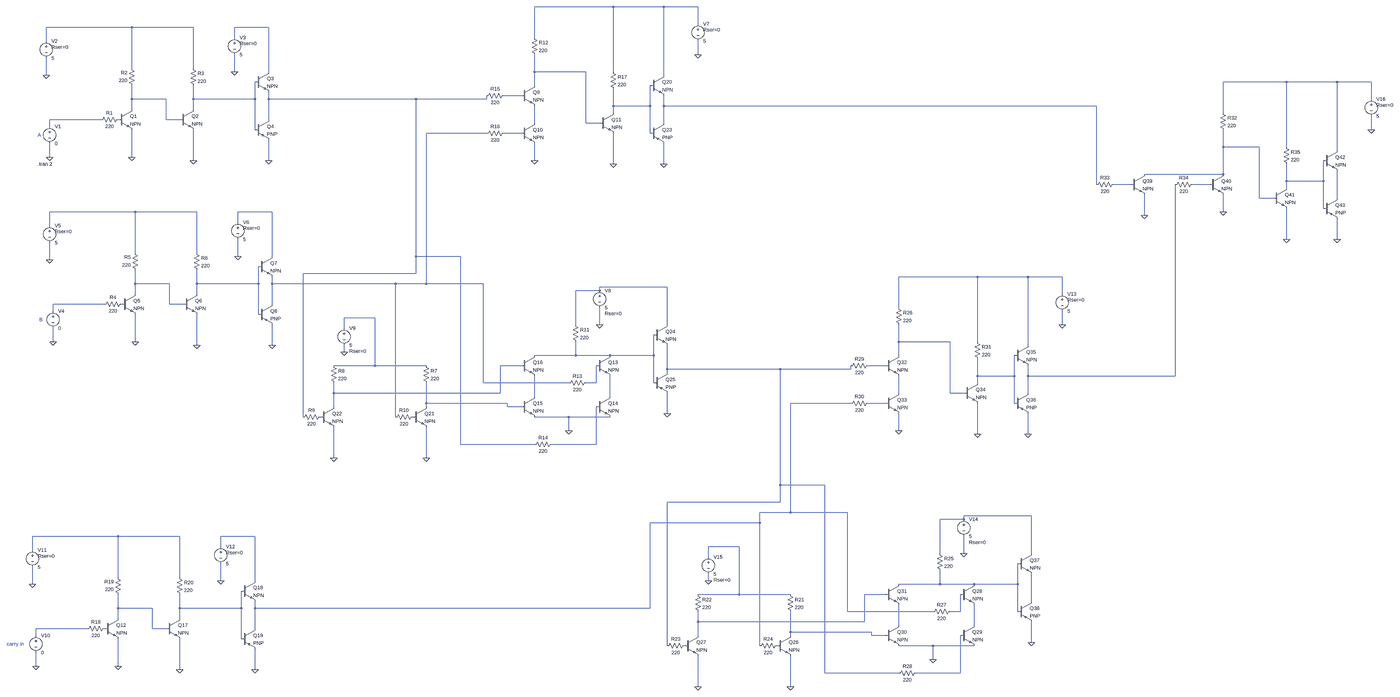
[diagram p0: schematic TTL Full Adder.asc, whole sheet]
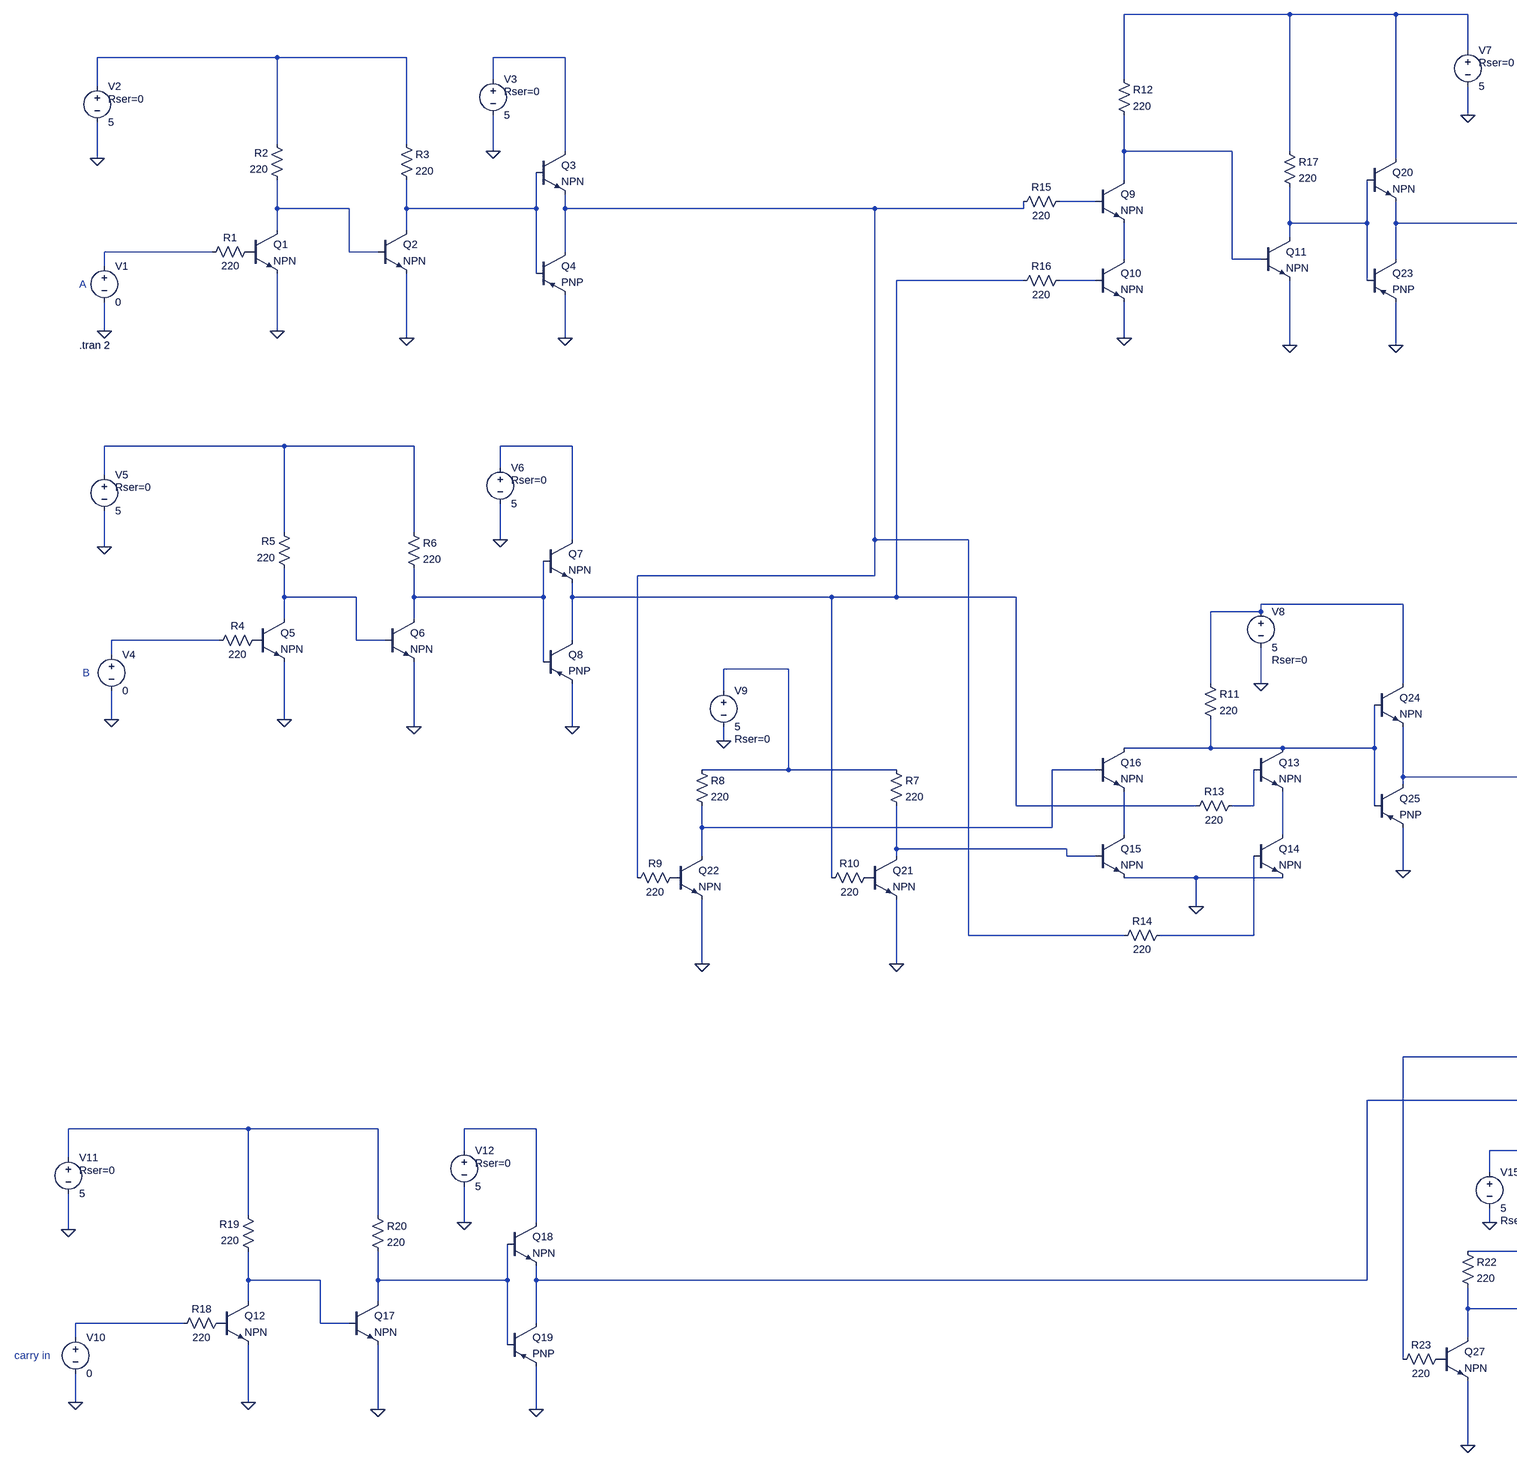
[diagram p1: schematic TTL Full Adder.asc, part, row 1 of 1, column 1 of 2]
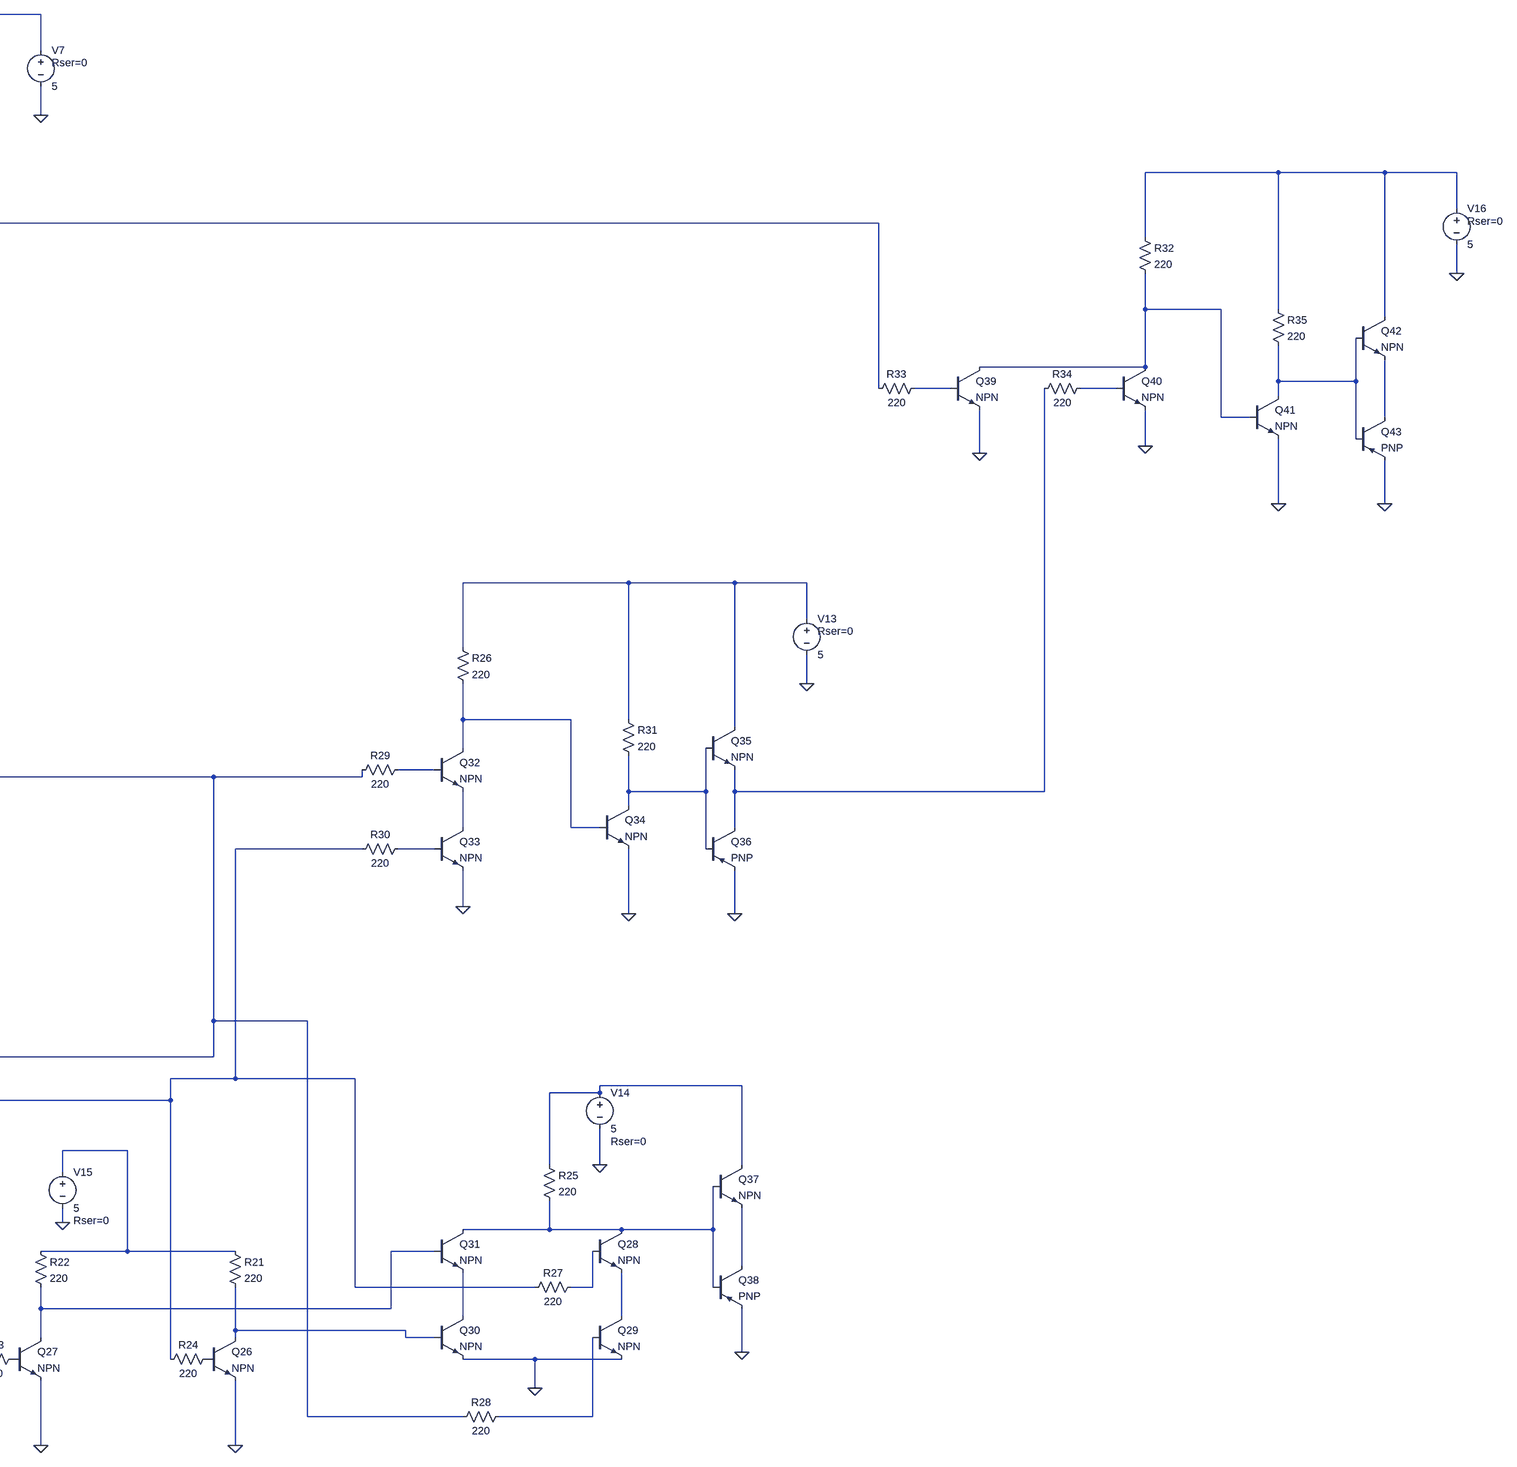
[diagram p2: schematic TTL Full Adder.asc, part, row 1 of 1, column 2 of 2]
TTL Full Adder.asc, the LTspice schematic file:
Version 4.1
SHEET 1 7312 2580
WIRE 3152 -816 2784 -816
WIRE 3488 -816 3152 -816
WIRE 3648 -816 3488 -816
WIRE 3648 -736 3648 -816
WIRE 576 -720 176 -720
WIRE 864 -720 576 -720
WIRE 1216 -720 1056 -720
WIRE 1056 -672 1056 -720
WIRE 2784 -672 2784 -816
WIRE 176 -656 176 -720
WIRE 3648 -592 3648 -656
WIRE 576 -528 576 -720
WIRE 864 -528 864 -720
WIRE 1056 -512 1056 -592
WIRE 1216 -512 1216 -720
WIRE 2784 -512 2784 -592
WIRE 3024 -512 2784 -512
WIRE 3152 -512 3152 -816
WIRE 176 -496 176 -576
WIRE 3488 -496 3488 -816
WIRE 6704 -464 6336 -464
WIRE 7040 -464 6704 -464
WIRE 7200 -464 7040 -464
WIRE 2784 -448 2784 -512
WIRE 2720 -400 2640 -400
WIRE 576 -384 576 -448
WIRE 736 -384 576 -384
WIRE 864 -384 864 -448
WIRE 1152 -384 1152 -464
WIRE 1152 -384 864 -384
WIRE 1216 -384 1216 -416
WIRE 2208 -384 1216 -384
WIRE 2560 -384 2560 -400
WIRE 2560 -384 2208 -384
WIRE 7200 -384 7200 -464
WIRE 3152 -352 3152 -432
WIRE 3424 -352 3424 -448
WIRE 3424 -352 3152 -352
WIRE 3488 -352 3488 -400
WIRE 5632 -352 3488 -352
WIRE 576 -336 576 -384
WIRE 864 -336 864 -384
WIRE 3152 -320 3152 -352
WIRE 6336 -320 6336 -464
WIRE 432 -288 192 -288
WIRE 736 -288 736 -384
WIRE 800 -288 736 -288
WIRE 1216 -288 1216 -384
WIRE 2784 -272 2784 -352
WIRE 3024 -272 3024 -512
WIRE 3088 -272 3024 -272
WIRE 3488 -272 3488 -352
WIRE 192 -256 192 -288
WIRE 1152 -240 1152 -384
WIRE 7200 -240 7200 -304
WIRE 2560 -224 2256 -224
WIRE 2720 -224 2640 -224
WIRE 3424 -224 3424 -352
WIRE 6336 -160 6336 -240
WIRE 6576 -160 6336 -160
WIRE 6704 -160 6704 -464
WIRE 7040 -144 7040 -464
WIRE 192 -112 192 -176
WIRE 576 -112 576 -240
WIRE 864 -96 864 -240
WIRE 1216 -96 1216 -192
WIRE 2784 -96 2784 -176
WIRE 3152 -80 3152 -224
WIRE 3488 -80 3488 -176
WIRE 6336 -32 6336 -160
WIRE 6336 -32 5856 -32
WIRE 6704 0 6704 -80
WIRE 6976 0 6976 -96
WIRE 6976 0 6704 0
WIRE 5632 16 5632 -352
WIRE 5792 16 5712 16
WIRE 6272 16 6192 16
WIRE 6704 32 6704 0
WIRE 6576 80 6576 -160
WIRE 6640 80 6576 80
WIRE 7040 80 7040 -48
WIRE 6976 128 6976 0
WIRE 592 144 192 144
WIRE 880 144 592 144
WIRE 1232 144 1072 144
WIRE 6336 144 6336 64
WIRE 5856 160 5856 64
WIRE 1072 192 1072 144
WIRE 192 208 192 144
WIRE 6704 272 6704 128
WIRE 7040 272 7040 176
WIRE 592 336 592 144
WIRE 880 336 880 144
WIRE 1072 352 1072 272
WIRE 1232 352 1232 144
WIRE 2208 352 2208 -384
WIRE 2416 352 2208 352
WIRE 192 368 192 288
WIRE 2208 432 2208 352
WIRE 2208 432 1680 432
WIRE 4976 448 4608 448
WIRE 5312 448 4976 448
WIRE 5472 448 5312 448
WIRE 592 480 592 416
WIRE 752 480 592 480
WIRE 880 480 880 416
WIRE 1168 480 1168 400
WIRE 1168 480 880 480
WIRE 1232 480 1232 448
WIRE 2112 480 1232 480
WIRE 2256 480 2256 -224
WIRE 2256 480 2112 480
WIRE 2544 480 2256 480
WIRE 3504 496 3088 496
WIRE 3088 512 3088 496
WIRE 3088 512 2976 512
WIRE 592 528 592 480
WIRE 880 528 880 480
WIRE 5472 528 5472 448
WIRE 448 576 208 576
WIRE 752 576 752 480
WIRE 816 576 752 576
WIRE 1232 576 1232 480
WIRE 4608 592 4608 448
WIRE 208 608 208 576
WIRE 1168 624 1168 480
WIRE 2016 640 1872 640
WIRE 2976 672 2976 512
WIRE 3088 672 3088 592
WIRE 3504 672 3504 496
WIRE 5472 672 5472 608
WIRE 1872 688 1872 640
WIRE 208 752 208 688
WIRE 592 752 592 624
WIRE 4608 752 4608 672
WIRE 4848 752 4608 752
WIRE 4976 752 4976 448
WIRE 880 768 880 624
WIRE 1232 768 1232 672
WIRE 5312 768 5312 448
WIRE 1872 800 1872 768
WIRE 2976 816 2976 752
WIRE 2976 816 2784 816
WIRE 3136 816 2976 816
WIRE 3440 816 3440 720
WIRE 3440 816 3136 816
WIRE 4608 816 4608 752
WIRE 2016 864 2016 640
WIRE 2016 864 1824 864
WIRE 2256 864 2016 864
WIRE 2720 864 2624 864
WIRE 4544 864 4464 864
WIRE 3504 880 3504 768
WIRE 4032 880 3504 880
WIRE 4384 880 4384 864
WIRE 4384 880 4032 880
WIRE 3504 896 3504 880
WIRE 4976 912 4976 832
WIRE 5248 912 5248 816
WIRE 5248 912 4976 912
WIRE 5312 912 5312 864
WIRE 6112 912 6112 16
WIRE 6112 912 5312 912
WIRE 2544 944 2544 480
WIRE 2944 944 2544 944
WIRE 3072 944 3072 864
WIRE 3072 944 3024 944
WIRE 3440 944 3440 816
WIRE 4976 944 4976 912
WIRE 1824 992 1824 944
WIRE 2624 992 2624 864
WIRE 2624 992 1824 992
WIRE 4608 992 4608 912
WIRE 4848 992 4848 752
WIRE 4912 992 4848 992
WIRE 5312 992 5312 912
WIRE 2784 1008 2784 912
WIRE 3136 1008 3136 912
WIRE 2256 1040 2256 944
WIRE 2656 1040 2256 1040
WIRE 4384 1040 4080 1040
WIRE 4544 1040 4464 1040
WIRE 5248 1040 5248 912
WIRE 1824 1056 1824 992
WIRE 2256 1056 2256 1040
WIRE 2656 1056 2656 1040
WIRE 2720 1056 2656 1056
WIRE 3504 1088 3504 992
WIRE 1680 1104 1680 432
WIRE 2112 1104 2112 480
WIRE 2944 1104 2784 1104
WIRE 3136 1104 2944 1104
WIRE 2944 1168 2944 1104
WIRE 4608 1168 4608 1088
WIRE 4976 1184 4976 1040
WIRE 5312 1184 5312 1088
WIRE 2416 1232 2416 352
WIRE 2784 1232 2416 1232
WIRE 3072 1232 3072 1056
WIRE 3072 1232 2864 1232
WIRE 1824 1296 1824 1152
WIRE 2256 1296 2256 1152
WIRE 4032 1616 4032 880
WIRE 4240 1616 4032 1616
WIRE 4032 1696 4032 1616
WIRE 4032 1696 3504 1696
WIRE 4080 1744 4080 1040
WIRE 4080 1744 3936 1744
WIRE 4368 1744 4080 1744
WIRE 5328 1760 4912 1760
WIRE 4912 1776 4912 1760
WIRE 4912 1776 4800 1776
WIRE 3936 1792 3936 1744
WIRE 3936 1792 3424 1792
WIRE 512 1856 112 1856
WIRE 800 1856 512 1856
WIRE 1152 1856 992 1856
WIRE 992 1904 992 1856
WIRE 3840 1904 3696 1904
WIRE 112 1920 112 1856
WIRE 4800 1936 4800 1776
WIRE 4912 1936 4912 1856
WIRE 5328 1936 5328 1760
WIRE 3696 1952 3696 1904
WIRE 512 2048 512 1856
WIRE 800 2048 800 1856
WIRE 992 2064 992 1984
WIRE 1152 2064 1152 1856
WIRE 3696 2064 3696 2032
WIRE 112 2080 112 2000
WIRE 4800 2080 4800 2016
WIRE 4800 2080 4608 2080
WIRE 4960 2080 4800 2080
WIRE 5264 2080 5264 1984
WIRE 5264 2080 4960 2080
WIRE 3840 2128 3840 1904
WIRE 3840 2128 3648 2128
WIRE 4080 2128 3840 2128
WIRE 4544 2128 4448 2128
WIRE 5328 2160 5328 2032
WIRE 512 2192 512 2128
WIRE 672 2192 512 2192
WIRE 800 2192 800 2128
WIRE 1088 2192 1088 2112
WIRE 1088 2192 800 2192
WIRE 1152 2192 1152 2160
WIRE 3424 2192 3424 1792
WIRE 3424 2192 1152 2192
WIRE 4368 2208 4368 1744
WIRE 4768 2208 4368 2208
WIRE 4896 2208 4896 2128
WIRE 4896 2208 4848 2208
WIRE 5264 2208 5264 2080
WIRE 512 2240 512 2192
WIRE 800 2240 800 2192
WIRE 3648 2256 3648 2208
WIRE 4448 2256 4448 2128
WIRE 4448 2256 3648 2256
WIRE 4608 2272 4608 2176
WIRE 4960 2272 4960 2176
WIRE 368 2288 128 2288
WIRE 672 2288 672 2192
WIRE 736 2288 672 2288
WIRE 1152 2288 1152 2192
WIRE 4080 2304 4080 2208
WIRE 4480 2304 4080 2304
WIRE 128 2320 128 2288
WIRE 3648 2320 3648 2256
WIRE 4080 2320 4080 2304
WIRE 4480 2320 4480 2304
WIRE 4544 2320 4480 2320
WIRE 1088 2336 1088 2192
WIRE 5328 2352 5328 2256
WIRE 3504 2368 3504 1696
WIRE 3936 2368 3936 1792
WIRE 4768 2368 4608 2368
WIRE 4960 2368 4768 2368
WIRE 4768 2432 4768 2368
WIRE 128 2464 128 2400
WIRE 512 2464 512 2336
WIRE 800 2480 800 2336
WIRE 1152 2480 1152 2384
WIRE 4240 2496 4240 1616
WIRE 4608 2496 4240 2496
WIRE 4896 2496 4896 2320
WIRE 4896 2496 4688 2496
WIRE 3648 2560 3648 2416
WIRE 4080 2560 4080 2416
FLAG 192 -112 0
FLAG 576 -112 0
FLAG 176 -496 0
FLAG 864 -96 0
FLAG 1056 -512 0
FLAG 1216 -96 0
FLAG 208 752 0
FLAG 592 752 0
FLAG 192 368 0
FLAG 880 768 0
FLAG 1072 352 0
FLAG 1232 768 0
FLAG 2944 1168 0
FLAG 3088 672 0
FLAG 2256 1296 0
FLAG 1824 1296 0
FLAG 1872 800 0
FLAG 2784 -96 0
FLAG 3152 -80 0
FLAG 128 2464 0
FLAG 512 2464 0
FLAG 112 2080 0
FLAG 800 2480 0
FLAG 992 2064 0
FLAG 1152 2480 0
FLAG 3488 -80 0
FLAG 3648 -592 0
FLAG 3504 1088 0
FLAG 4768 2432 0
FLAG 4912 1936 0
FLAG 4080 2560 0
FLAG 3648 2560 0
FLAG 3696 2064 0
FLAG 4608 1168 0
FLAG 4976 1184 0
FLAG 5312 1184 0
FLAG 5472 672 0
FLAG 5328 2352 0
FLAG 6336 144 0
FLAG 6704 272 0
FLAG 7040 272 0
FLAG 7200 -240 0
FLAG 5856 160 0
SYMBOL voltage 192 -272 R0
WINDOW 123 0 0 Left 0
WINDOW 39 0 0 Left 0
SYMATTR InstName V1
SYMATTR Value 0
SYMBOL npn 512 -336 R0
SYMATTR InstName Q1
SYMBOL res 528 -304 R90
WINDOW 0 0 56 VBottom 2
WINDOW 3 32 56 VTop 2
SYMATTR InstName R1
SYMATTR Value 220
SYMBOL res 592 -432 R180
WINDOW 0 36 76 Left 2
WINDOW 3 36 40 Left 2
SYMATTR InstName R2
SYMATTR Value 220
SYMBOL voltage 176 -672 R0
WINDOW 123 0 0 Left 0
WINDOW 39 24 44 Left 2
SYMATTR InstName V2
SYMATTR Value 5
SYMATTR SpiceLine Rser=0
SYMBOL res 848 -544 R0
SYMATTR InstName R3
SYMATTR Value 220
SYMBOL npn 800 -336 R0
SYMATTR InstName Q2
SYMBOL npn 1152 -512 R0
SYMATTR InstName Q3
SYMBOL pnp 1152 -288 R0
SYMATTR InstName Q4
SYMBOL voltage 1056 -688 R0
WINDOW 123 0 0 Left 0
WINDOW 39 24 44 Left 2
SYMATTR InstName V3
SYMATTR Value 5
SYMATTR SpiceLine Rser=0
SYMBOL voltage 208 592 R0
WINDOW 123 0 0 Left 0
WINDOW 39 0 0 Left 0
SYMATTR InstName V4
SYMATTR Value 0
SYMBOL npn 528 528 R0
SYMATTR InstName Q5
SYMBOL res 544 560 R90
WINDOW 0 0 56 VBottom 2
WINDOW 3 32 56 VTop 2
SYMATTR InstName R4
SYMATTR Value 220
SYMBOL res 608 432 R180
WINDOW 0 36 76 Left 2
WINDOW 3 36 40 Left 2
SYMATTR InstName R5
SYMATTR Value 220
SYMBOL voltage 192 192 R0
WINDOW 123 0 0 Left 0
WINDOW 39 24 44 Left 2
SYMATTR InstName V5
SYMATTR Value 5
SYMATTR SpiceLine Rser=0
SYMBOL res 864 320 R0
SYMATTR InstName R6
SYMATTR Value 220
SYMBOL npn 816 528 R0
SYMATTR InstName Q6
SYMBOL npn 1168 352 R0
SYMATTR InstName Q7
SYMBOL pnp 1168 576 R0
SYMATTR InstName Q8
SYMBOL voltage 1072 176 R0
WINDOW 123 0 0 Left 0
WINDOW 39 24 44 Left 2
SYMATTR InstName V6
SYMATTR Value 5
SYMATTR SpiceLine Rser=0
SYMBOL voltage 3648 -752 R0
WINDOW 123 0 0 Left 0
WINDOW 39 24 44 Left 2
SYMATTR InstName V7
SYMATTR Value 5
SYMATTR SpiceLine Rser=0
SYMBOL voltage 3088 496 R0
WINDOW 123 0 0 Left 0
WINDOW 39 24 124 Left 2
SYMATTR InstName V8
SYMATTR Value 5
SYMATTR SpiceLine Rser=0
SYMBOL res 2240 848 R0
SYMATTR InstName R7
SYMATTR Value 220
SYMBOL npn 2192 1056 R0
SYMATTR InstName Q21
SYMBOL res 1808 848 R0
SYMATTR InstName R8
SYMATTR Value 220
SYMBOL npn 1760 1056 R0
SYMATTR InstName Q22
SYMBOL res 1776 1088 R90
WINDOW 0 0 56 VBottom 2
WINDOW 3 32 56 VTop 2
SYMATTR InstName R9
SYMATTR Value 220
SYMBOL res 2208 1088 R90
WINDOW 0 0 56 VBottom 2
WINDOW 3 32 56 VTop 2
SYMATTR InstName R10
SYMATTR Value 220
SYMBOL voltage 1872 672 R0
WINDOW 123 0 0 Left 0
WINDOW 39 24 124 Left 2
SYMATTR InstName V9
SYMATTR Value 5
SYMATTR SpiceLine Rser=0
SYMBOL res 2960 656 R0
SYMATTR InstName R11
SYMATTR Value 220
SYMBOL npn 3072 816 R0
SYMATTR InstName Q13
SYMBOL npn 3072 1008 R0
SYMATTR InstName Q14
SYMBOL npn 2720 1008 R0
SYMATTR InstName Q15
SYMBOL npn 2720 816 R0
SYMATTR InstName Q16
SYMBOL res 2768 -688 R0
SYMATTR InstName R12
SYMATTR Value 220
SYMBOL res 3040 928 R90
WINDOW 0 0 56 VBottom 2
WINDOW 3 32 56 VTop 2
SYMATTR InstName R13
SYMATTR Value 220
SYMBOL res 2880 1216 R90
WINDOW 0 0 56 VBottom 2
WINDOW 3 32 56 VTop 2
SYMATTR InstName R14
SYMATTR Value 220
SYMBOL npn 2720 -448 R0
SYMATTR InstName Q9
SYMBOL npn 2720 -272 R0
SYMATTR InstName Q10
SYMBOL res 2656 -416 R90
WINDOW 0 0 56 VBottom 2
WINDOW 3 32 56 VTop 2
SYMATTR InstName R15
SYMATTR Value 220
SYMBOL res 2656 -240 R90
WINDOW 0 0 56 VBottom 2
WINDOW 3 32 56 VTop 2
SYMATTR InstName R16
SYMATTR Value 220
SYMBOL res 3136 -528 R0
SYMATTR InstName R17
SYMATTR Value 220
SYMBOL npn 3088 -320 R0
SYMATTR InstName Q11
SYMBOL voltage 128 2304 R0
WINDOW 123 0 0 Left 0
WINDOW 39 0 0 Left 0
SYMATTR InstName V10
SYMATTR Value 0
SYMBOL npn 448 2240 R0
SYMATTR InstName Q12
SYMBOL res 464 2272 R90
WINDOW 0 0 56 VBottom 2
WINDOW 3 32 56 VTop 2
SYMATTR InstName R18
SYMATTR Value 220
SYMBOL res 528 2144 R180
WINDOW 0 36 76 Left 2
WINDOW 3 36 40 Left 2
SYMATTR InstName R19
SYMATTR Value 220
SYMBOL voltage 112 1904 R0
WINDOW 123 0 0 Left 0
WINDOW 39 24 44 Left 2
SYMATTR InstName V11
SYMATTR Value 5
SYMATTR SpiceLine Rser=0
SYMBOL res 784 2032 R0
SYMATTR InstName R20
SYMATTR Value 220
SYMBOL npn 736 2240 R0
SYMATTR InstName Q17
SYMBOL npn 1088 2064 R0
SYMATTR InstName Q18
SYMBOL pnp 1088 2288 R0
SYMATTR InstName Q19
SYMBOL voltage 992 1888 R0
WINDOW 123 0 0 Left 0
WINDOW 39 24 44 Left 2
SYMATTR InstName V12
SYMATTR Value 5
SYMATTR SpiceLine Rser=0
SYMBOL npn 3424 -496 R0
SYMATTR InstName Q20
SYMBOL pnp 3424 -272 R0
SYMATTR InstName Q23
SYMBOL npn 3440 672 R0
SYMATTR InstName Q24
SYMBOL pnp 3440 896 R0
SYMATTR InstName Q25
SYMBOL voltage 5472 512 R0
WINDOW 123 0 0 Left 0
WINDOW 39 24 44 Left 2
SYMATTR InstName V13
SYMATTR Value 5
SYMATTR SpiceLine Rser=0
SYMBOL voltage 4912 1760 R0
WINDOW 123 0 0 Left 0
WINDOW 39 24 124 Left 2
SYMATTR InstName V14
SYMATTR Value 5
SYMATTR SpiceLine Rser=0
SYMBOL res 4064 2112 R0
SYMATTR InstName R21
SYMATTR Value 220
SYMBOL npn 4016 2320 R0
SYMATTR InstName Q26
SYMBOL res 3632 2112 R0
SYMATTR InstName R22
SYMATTR Value 220
SYMBOL npn 3584 2320 R0
SYMATTR InstName Q27
SYMBOL res 3600 2352 R90
WINDOW 0 0 56 VBottom 2
WINDOW 3 32 56 VTop 2
SYMATTR InstName R23
SYMATTR Value 220
SYMBOL res 4032 2352 R90
WINDOW 0 0 56 VBottom 2
WINDOW 3 32 56 VTop 2
SYMATTR InstName R24
SYMATTR Value 220
SYMBOL voltage 3696 1936 R0
WINDOW 123 0 0 Left 0
WINDOW 39 24 124 Left 2
SYMATTR InstName V15
SYMATTR Value 5
SYMATTR SpiceLine Rser=0
SYMBOL res 4784 1920 R0
SYMATTR InstName R25
SYMATTR Value 220
SYMBOL npn 4896 2080 R0
SYMATTR InstName Q28
SYMBOL npn 4896 2272 R0
SYMATTR InstName Q29
SYMBOL npn 4544 2272 R0
SYMATTR InstName Q30
SYMBOL npn 4544 2080 R0
SYMATTR InstName Q31
SYMBOL res 4592 576 R0
SYMATTR InstName R26
SYMATTR Value 220
SYMBOL res 4864 2192 R90
WINDOW 0 0 56 VBottom 2
WINDOW 3 32 56 VTop 2
SYMATTR InstName R27
SYMATTR Value 220
SYMBOL res 4704 2480 R90
WINDOW 0 0 56 VBottom 2
WINDOW 3 32 56 VTop 2
SYMATTR InstName R28
SYMATTR Value 220
SYMBOL npn 4544 816 R0
SYMATTR InstName Q32
SYMBOL npn 4544 992 R0
SYMATTR InstName Q33
SYMBOL res 4480 848 R90
WINDOW 0 0 56 VBottom 2
WINDOW 3 32 56 VTop 2
SYMATTR InstName R29
SYMATTR Value 220
SYMBOL res 4480 1024 R90
WINDOW 0 0 56 VBottom 2
WINDOW 3 32 56 VTop 2
SYMATTR InstName R30
SYMATTR Value 220
SYMBOL res 4960 736 R0
SYMATTR InstName R31
SYMATTR Value 220
SYMBOL npn 4912 944 R0
SYMATTR InstName Q34
SYMBOL npn 5248 768 R0
SYMATTR InstName Q35
SYMBOL pnp 5248 992 R0
SYMATTR InstName Q36
SYMBOL npn 5264 1936 R0
SYMATTR InstName Q37
SYMBOL pnp 5264 2160 R0
SYMATTR InstName Q38
SYMBOL voltage 7200 -400 R0
WINDOW 123 0 0 Left 0
WINDOW 39 24 44 Left 2
SYMATTR InstName V16
SYMATTR Value 5
SYMATTR SpiceLine Rser=0
SYMBOL res 6320 -336 R0
SYMATTR InstName R32
SYMATTR Value 220
SYMBOL npn 5792 -32 R0
SYMATTR InstName Q39
SYMBOL npn 6272 -32 R0
SYMATTR InstName Q40
SYMBOL res 5728 0 R90
WINDOW 0 0 56 VBottom 2
WINDOW 3 32 56 VTop 2
SYMATTR InstName R33
SYMATTR Value 220
SYMBOL res 6208 0 R90
WINDOW 0 0 56 VBottom 2
WINDOW 3 32 56 VTop 2
SYMATTR InstName R34
SYMATTR Value 220
SYMBOL res 6688 -176 R0
SYMATTR InstName R35
SYMATTR Value 220
SYMBOL npn 6640 32 R0
SYMATTR InstName Q41
SYMBOL npn 6976 -144 R0
SYMATTR InstName Q42
SYMBOL pnp 6976 80 R0
SYMATTR InstName Q43
TEXT 136 -80 Left 2 !.tran 2
TEXT 136 -216 Left 2 ;A
TEXT 144 648 Left 2 ;B
TEXT -8 2360 Left 2 ;carry in

The netlist it stands for:
* TTL Full Adder.asc
V1 N012 0 0
Q1 N007 P001 0 0 NPN
R1 P001 N012 220
R2 N007 N002 220
V2 N002 0 5 Rser=0
R3 N002 N008 220
Q2 N008 N007 0 0 NPN
Q3 N003 N008 N009 0 NPN
Q4 N009 N008 0 0 PNP
V3 N003 0 5 Rser=0
V4 N027 0 0
Q5 N024 P002 0 0 NPN
R4 P002 N027 220
R5 N024 N021 220
V5 N021 0 5 Rser=0
R6 N021 N025 220
Q6 N025 N024 0 0 NPN
Q7 N022 N025 N014 0 NPN
Q8 N014 N025 0 0 PNP
V6 N022 0 5 Rser=0
V7 N001 0 5 Rser=0
V8 N026 0 5 Rser=0
R7 N028 N040 220
Q21 N040 P003 0 0 NPN
R8 N028 N031 220
Q22 N031 P004 0 0 NPN
R9 P004 N009 220
R10 P003 N014 220
V9 N028 0 5 Rser=0
R11 N026 N030 220
Q13 N030 N036 N039 0 NPN
Q14 N039 N043 0 0 NPN
Q15 N038 N040 0 0 NPN
Q16 N030 N031 N038 0 NPN
R12 N001 N004 220
R13 N036 N014 220
R14 N043 N009 220
Q9 N004 N006 N013 0 NPN
Q10 N013 N015 0 0 NPN
R15 N006 N009 220
R16 N015 N014 220
R17 N001 N010 220
Q11 N010 N004 0 0 NPN
V10 N056 0 0
Q12 N051 P005 0 0 NPN
R18 P005 N056 220
R19 N051 N045 220
V11 N045 0 5 Rser=0
R20 N045 N052 220
Q17 N052 N051 0 0 NPN
Q18 N046 N052 N041 0 NPN
Q19 N041 N052 0 0 PNP
V12 N046 0 5 Rser=0
Q20 N001 N010 N011 0 NPN
Q23 N011 N010 0 0 PNP
Q24 N026 N030 N033 0 NPN
Q25 N033 N030 0 0 PNP
V13 N023 0 5 Rser=0
V14 N044 0 5 Rser=0
R21 N047 N057 220
Q26 N057 P006 0 0 NPN
R22 N047 N049 220
Q27 N049 P007 0 0 NPN
R23 P007 N033 220
R24 P006 N041 220
V15 N047 0 5 Rser=0
R25 N044 N048 220
Q28 N048 N053 N055 0 NPN
Q29 N055 N058 0 0 NPN
Q30 N054 N057 0 0 NPN
Q31 N048 N049 N054 0 NPN
R26 N023 N029 220
R27 N053 N041 220
R28 N058 N033 220
Q32 N029 N032 N037 0 NPN
Q33 N037 N042 0 0 NPN
R29 N032 N033 220
R30 N042 N041 220
R31 N023 N034 220
Q34 N034 N029 0 0 NPN
Q35 N023 N034 N035 0 NPN
Q36 N035 N034 0 0 PNP
Q37 N044 N048 N050 0 NPN
Q38 N050 N048 0 0 PNP
V16 N005 0 5 Rser=0
R32 N005 N016 220
Q39 N016 N018 0 0 NPN
Q40 N016 N019 0 0 NPN
R33 N018 N011 220
R34 N019 N035 220
R35 N005 N017 220
Q41 N017 N016 0 0 NPN
Q42 N005 N017 N020 0 NPN
Q43 N020 N017 0 0 PNP
.model NPN NPN
.model PNP PNP
.lib standard.bjt
.tran 2
* A
* B
* carry in
.backanno
.end